# Altium schematic sheet SOM_Codec_WM8731.SchDoc
size A2; SheetNumber: 1; SheetTotal: 1
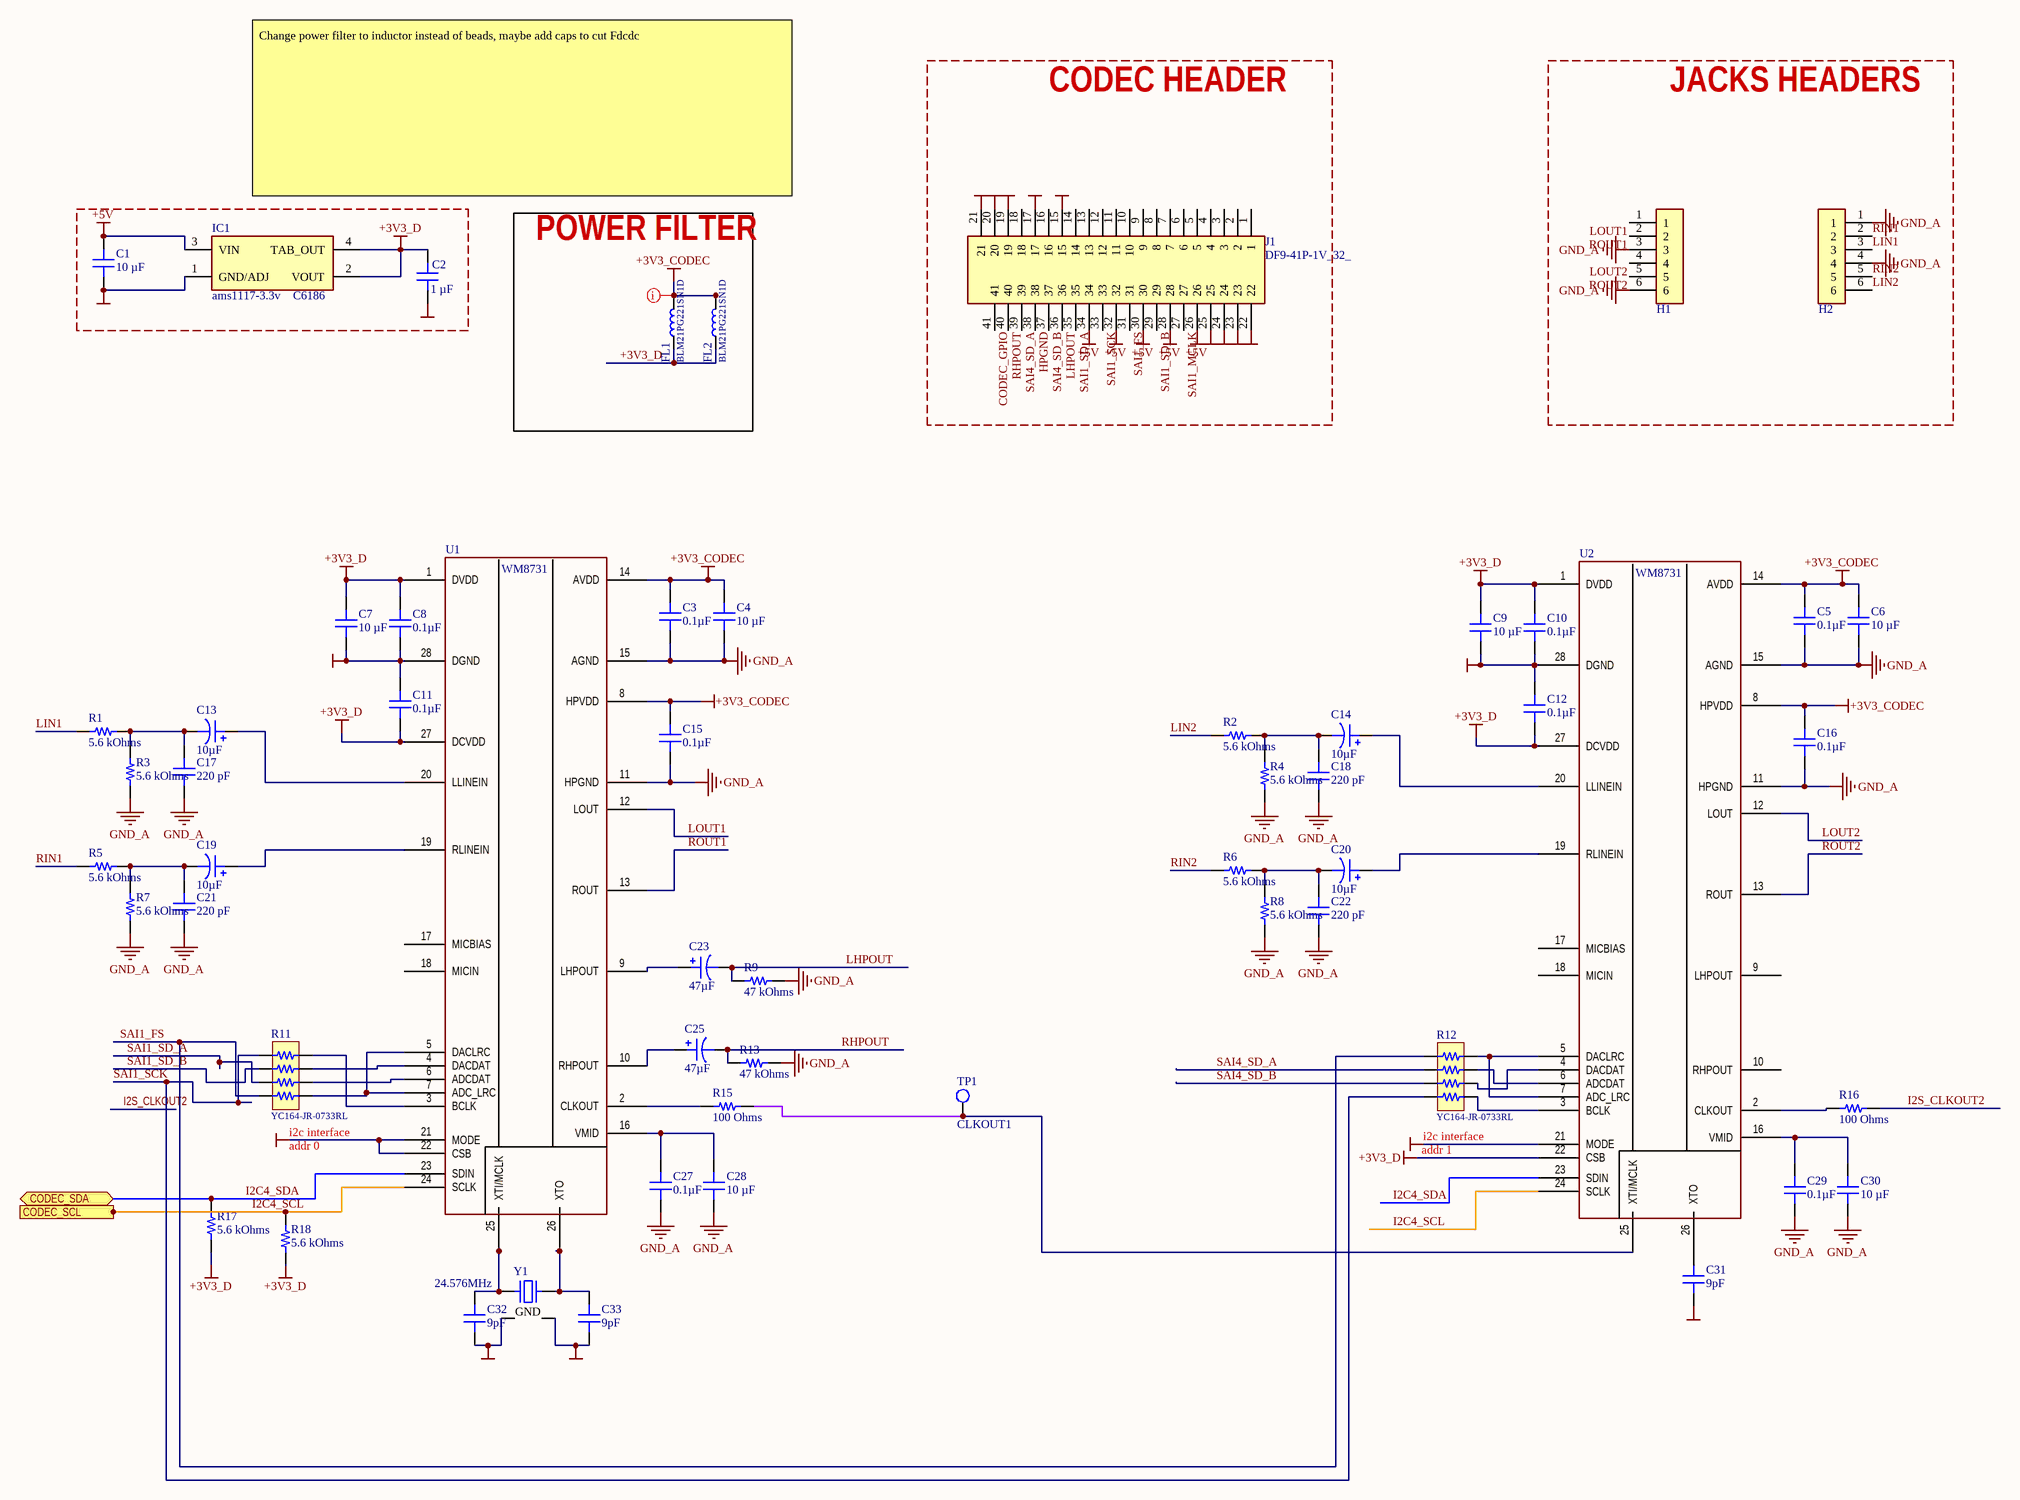
[diagram p0: SOM_Codec_WM8731.SchDoc]

## Parts
C1  10 µF  [CAP 0805_2012]
C2  1 µF  [CAP 0805_2012]
C3  0.1µF  [CAP 0402_1005]
C4  10 µF  [CAP 0805_2012]
C5  0.1µF  [CAP 0402_1005]
C6  10 µF  [CAP 0805_2012]
C7  10 µF  [CAP 0805_2012]
C8  0.1µF  [CAP 0402_1005]
C9  10 µF  [CAP 0805_2012]
C10  0.1µF  [CAP 0402_1005]
C11  0.1µF  [CAP 0402_1005]
C12  0.1µF  [CAP 0402_1005]
C13  10µF  [CAP POL 1206_3216]
C14  10µF  [CAP POL 1206_3216]
C15  0.1µF  [CAP 0402_1005]
C16  0.1µF  [CAP 0402_1005]
C17  220 pF  [CAP 0603_1608]
C18  220 pF  [CAP 0603_1608]
C19  10µF  [CAP POL 1206_3216]
C20  10µF  [CAP POL 1206_3216]
C21  220 pF  [CAP 0603_1608]
C22  220 pF  [CAP 0603_1608]
C23  47µF  [CAP POL 2917_7343]
C25  47µF  [CAP POL 2917_7343]
C27  0.1µF  [CAP 0402_1005]
C28  10 µF  [CAP 0805_2012]
C29  0.1µF  [CAP 0402_1005]
C30  10 µF  [CAP 0805_2012]
C31  9pF  [CAP 0805_2012]
C32  9pF  [CAP 0805_2012]
C33  9pF  [CAP 0805_2012]
FL1  BLM21PG221SN1D  [0805_IND]
FL2  BLM21PG221SN1D  [0805_IND]
H1  1.5-6A  [1.5-6A]  (value not drawn)
H2  1.5-6A  [1.5-6A]  (value not drawn)
IC1  ams1117-3.3v  Supplier Part Number 1: C6186  [SOT-223]
J1  DF9-41P-1V_32_  [HIROSE_DF9-41P-1V(32)]
R1  5.6 kOhms  [RES 0603_1608]
R2  5.6 kOhms  [RES 0603_1608]
R3  5.6 kOhms  [RES 0603_1608]
R4  5.6 kOhms  [RES 0603_1608]
R5  5.6 kOhms  [RES 0603_1608]
R6  5.6 kOhms  [RES 0603_1608]
R7  5.6 kOhms  [RES 0603_1608]
R8  5.6 kOhms  [RES 0603_1608]
R9  47 kOhms  [RES 0603_1608]
R11  YC164-JR-0733RL  [RESNET 1206-8 CONVEX]
R12  YC164-JR-0733RL  [RESNET 1206-8 CONVEX]
R13  47 kOhms  [RES 0603_1608]
R15  100 Ohms  [RES 0402_1005]
R16  100 Ohms  [RES 0402_1005]
R17  5.6 kOhms  [RES 0603_1608]
R18  5.6 kOhms  [RES 0603_1608]
TP1  CLKOUT1  [TESTPOINT]  (no BOM)
U1  WM8731  [TSSOP-28]
U2  WM8731  [TSSOP-28]
Y1  24.576MHz  [ABRACON ABM8G]

## Blocks framed on the sheet
CODEC HEADER: J1
JACKS HEADERS: H1 H2
POWER FILTER: FL1 FL2

## Ports
CODEC_SCL (in), CODEC_SDA (bidir)

## Nets
+3V3_CODEC: C3.2 C4.2 C5.2 C6.2 C15.2 C16.2 FL1.2 FL2.2 U1.8(HPVDD) U1.14(AVDD) U2.8(HPVDD) U2.14(AVDD)
+3V3_D: C2.2 C7.2 C8.2 C9.2 C10.2 C11.1 C12.1 FL1.1 FL2.1 IC1.2(VOUT) IC1.4(TAB_OUT) R17.1 R18.1 U1.1(DVDD) U1.27(DCVDD) U2.1(DVDD) U2.22(CSB) U2.27(DCVDD)
+5V: C1.2 IC1.3(VIN) J1.26 J1.28 J1.30 J1.32 J1.34
GND: C1.1 C2.1 C7.1 C8.1 C9.1 C10.1 C11.2 C12.2 C31.2 C32.2 C33.2 IC1.1(GND/ADJ) J1.15 J1.17 J1.19 J1.20 J1.21 J1.22 J1.23 J1.24 J1.25 U1.21(MODE) U1.22(CSB) U1.28(DGND) U2.21(MODE) U2.28(DGND) Y1.2(GND) Y1.4(GND)
GND_A: C3.1 C4.1 C5.1 C6.1 C15.1 C16.1 C17.1 C18.1 C21.1 C22.1 C27.2 C28.2 C29.2 C30.2 H1.3 H1.6 H2.1 H2.4 R3.1 R4.1 R7.1 R8.1 R9.2 R13.2 U1.11(HPGND) U1.15(AGND) U2.11(HPGND) U2.15(AGND)
CODEC_GPIO: J1.41
HPGND: J1.38
I2C4_SCL: R18.2 U1.24(SCLK) U2.24(SCLK) ; port CODEC_SCL
I2C4_SDA: R17.2 U1.23(SDIN) U2.23(SDIN) ; port CODEC_SDA
I2S_CLKOUT2: R16.2
LHPOUT: C23.2 J1.36 R9.1
LIN1: H2.3 R1.1
LIN2: H2.6 R2.1
LOUT1: H1.1 U1.12(LOUT)
LOUT2: H1.4 U2.12(LOUT)
RHPOUT: C25.2 J1.40 R13.1
RIN1: H2.2 R5.1
RIN2: H2.5 R6.1
ROUT1: H1.2 U1.13(ROUT)
ROUT2: H1.5 U2.13(ROUT)
SAI1_FS: J1.31 R11.4 R12.1
SAI1_MCLK: J1.27
SAI1_SCK: J1.33 R11.1 R12.4
SAI1_SD_A: J1.35 R11.3
SAI1_SD_B: J1.29 R11.2
SAI4_SD_A: J1.39 R12.2
SAI4_SD_B: J1.37 R12.3
NetC13_1: C13.1 U1.20(LLINEIN)
NetC13_2: C13.2 C17.2 R1.2 R3.2
NetC14_1: C14.1 U2.20(LLINEIN)
NetC14_2: C14.2 C18.2 R2.2 R4.2
NetC19_1: C19.1 U1.19(RLINEIN)
NetC19_2: C19.2 C21.2 R5.2 R7.2
NetC20_1: C20.1 U2.19(RLINEIN)
NetC20_2: C20.2 C22.2 R6.2 R8.2
NetC23_1: C23.1 U1.9(LHPOUT)
NetC25_1: C25.1 U1.10(RHPOUT)
NetC27_1: C27.1 C28.1 U1.16(VMID)
NetC29_1: C29.1 C30.1 U2.16(VMID)
NetC31_1: C31.1 U2.26(XTO)
NetC32_1: C32.1 U1.25(XTI/MCLK) Y1.1
NetC33_1: C33.1 U1.26(XTO) Y1.3
NetR11_5: R11.5 U1.5(DACLRC) U1.7(ADC_LRC)
NetR11_6: R11.6 U1.6(ADCDAT)
NetR11_7: R11.7 U1.4(DACDAT)
NetR11_8: R11.8 U1.3(BCLK)
NetR12_5: R12.5 U2.3(BCLK)
NetR12_6: R12.6 U2.4(DACDAT)
NetR12_7: R12.7 U2.6(ADCDAT)
NetR12_8: R12.8 U2.5(DACLRC) U2.7(ADC_LRC)
NetR15_1: R15.1 U1.2(CLKOUT)
NetR15_2: R15.2 TP1.1 U2.25(XTI/MCLK)
NetR16_1: R16.1 U2.2(CLKOUT)

Not connected (* = marked no-connect by the designer): J1 1 2 3 4 5 6 7 8 9 10 11 12 13 14 16 18; U1 17(MICBIAS) 18(MICIN); U2 9(LHPOUT) 10(RHPOUT) 17(MICBIAS) 18(MICIN)

## Layout directives
net class PowerNet: +3V3_CODEC

## Notes on the sheet
- Change power filter to inductor instead of beads, maybe add caps to cut Fdcdc
- (near R11) i2c interface
- (near R11) addr 0
- (near R12) addr 1
- (near R12) i2c interface

## Library data of the parts
C1 C4 C6 C7 C9 C28 C30 = C0805C106K8PAC7800: CAP CER 10UF 10V X5R 0805; manufacturer: KEMET; Tolerance: ±10%; Part Number: C0805C106K8PAC7800; Value: 10 µF; Applications: Bypass, Decoupling; Capacitance: 10 µF; componentlink1description: Datasheet; componentlink1url: https://connect.kemet.com:7667/gateway/IntelliData-ComponentDocumentation/1.0/download/datasheet/C0805C106K8PACTU; componentlink2description: DigiKey Link; componentlink2url: https://www.digikey.com/en/products/detail/kemet/C0805C106K8PAC7800/1090830; Device Package: 0805 (2012 Metric); Lifecycle Status: Active; Minimum Order: 1; Mounting Type: Surface Mount, MLCC; Operating Temperature: -55°C ~ 85°C; Package / Case: 0805 (2012 Metric); packaging: TapeAndReel; partid: 44790; Part Status: Active; series: SMD Comm X5R; Size / Dimension: 0.079" L x 0.049" W (2.00mm x 1.25mm); Supplier 1: DigiKey; Supplier Part Number 1: 399-C0805C106K8PAC7800CT-ND; Temperature Coefficient: X5R; Thickness (Max): 0.055" (1.40mm); Voltage - Rated: 10V
  C1: lastupdated: 9/14/2022 7:51:56 AM; price: 0.02
  C4 C6 C7 C9 C28 C30: lastupdated: 9/22/2023 7:11:46 PM; price: 0.01
C2 = C0805C105K4RAC7800: CAP CER 1UF 16V X7R 0805; manufacturer: KEMET; Tolerance: ±10%; Part Number: C0805C105K4RAC7800; Value: 1 µF; Applications: Bypass, Decoupling; Capacitance: 1 µF; componentlink1description: Datasheet; componentlink1url: https://api.kemet.com/component-edge/download/datasheet/C0805C105K4RACTU.pdf; componentlink2description: DigiKey Link; componentlink2url: https://www.digikey.com/en/products/detail/kemet/C0805C105K4RAC7800/416047; Device Package: 0805 (2012 Metric); lastupdated: 9/19/2022 1:03:30 PM; Lifecycle Status: Active; Minimum Order: 1; Mounting Type: Surface Mount, MLCC; Operating Temperature: -55°C ~ 125°C; Package / Case: 0805 (2012 Metric); packaging: TapeAndReel; partid: 32075; Part Status: Active; price: 0.01; series: SMD Comm X7R; Size / Dimension: 0.079" L x 0.049" W (2.00mm x 1.25mm); Supplier 1: DigiKey; Supplier Part Number 1: 399-C0805C105K4RAC7800CT-ND; Temperature Coefficient: X7R; Thickness (Max): 0.039" (1.00mm); Voltage - Rated: 16V
C3 C5 C8 C10-C12 C15 C16 C27 C29 = C0402C104K4RACAUTO: CAP CER 0.1UF 16V X7R 0402; Manufacturer: KEMET; Tolerance: ±10%; Part Number: C0402C104K4RACAUTO; Value: 0.1µF; Applications: Automotive, Bypass, Decoupling; Capacitance: 0.1µF; ComponentLink1Description: Datasheet; ComponentLink1URL: https://api.kemet.com/component-edge/download/specsheet/C0402C104K4RACAUTO.pdf; ComponentLink2Description: DigiKey Link; ComponentLink2URL: http://digikey.com/product-detail/en/kemet/C0402C104K4RACAUTO/399-6828-1-ND/3314343; Device Package: 0402 (1005 Metric); LastUpdated: 9/2/2020 1:02:21 AM; Lifecycle Status: Active; Minimum Order: 1; Mounting Type: Surface Mount, MLCC; Operating Temperature: -55°C ~ 125°C; Package / Case: 0402 (1005 Metric); Packaging: TapeAndReel; PartId: 3024; Part Status: Active; Price: 0.01; Ratings: AEC-Q200; Series: SMD Auto X7R; Size / Dimension: 0.039" L x 0.020" W (1.00mm x 0.50mm); Supplier 1: DigiKey; Supplier Part Number 1: 399-6828-1-ND; Temperature Coefficient: X7R; Thickness (Max): 0.022" (0.55mm); Voltage - Rated: 16V
C13 C14 C19 C20 = T491A106K010AT: CAP TANT 10UF 10% 10V 1206; Manufacturer: KEMET; Manufacturer Size Code: A; ESR (Equivalent Series Resistance): 3.8Ohm; Lifetime @ Temp.: 2000 Hrs @ 125°C; Type: Molded; Part Number: T491A106K010AT; Value: 10µF; Capacitance: 10µF; ComponentLink1Description: Datasheet; ComponentLink1URL: https://api.kemet.com/component-edge/download/datasheet/T491A106K010AT.pdf; ComponentLink2Description: DigiKey Link; ComponentLink2URL: http://digikey.com/product-detail/en/kemet/T491A106K010AT/399-3684-1-ND/819009; Device Package: 1206 (3216 Metric); Features: General Purpose; Height - Seated (Max): 0.071" (1.80mm); LastUpdated: 9/2/2020 1:15:58 AM; Lifecycle Status: Active; Minimum Order: 1; Mounting Type: Surface Mount; Operating Temperature: -55°C ~ 125°C; Package / Case: 1206 (3216 Metric); Packaging: TapeAndReel; PartId: 330; Part Status: Active; Price: 0.07; Series: T491; Size / Dimension: 0.126" L x 0.063" W (3.20mm x 1.60mm); Supplier 1: DigiKey; Supplier Part Number 1: 399-3684-1-ND; Tolerance: ±10%; Voltage - Rated: 10V
C17 C18 C21 C22 = C0603C221K5RAC7867: CAP CER 220PF 50V X7R 0603; manufacturer: KEMET; Tolerance: ±10%; Part Number: C0603C221K5RAC7867; Value: 220 pF; Applications: Bypass, Decoupling; Capacitance: 220 pF; componentlink1description: Datasheet; componentlink1url: https://api.kemet.com/component-edge/download/datasheet/C0603C221K5RACTU.pdf; componentlink2description: DigiKey Link; componentlink2url: https://www.digikey.com/en/products/detail/kemet/C0603C221K5RAC7867/411073; Device Package: 0603 (1608 Metric); lastupdated: 9/22/2023 7:08:22 PM; Lifecycle Status: Active; Minimum Order: 1; Mounting Type: Surface Mount, MLCC; Operating Temperature: -55°C ~ 125°C; Package / Case: 0603 (1608 Metric); packaging: TapeAndReel; partid: 35307; Part Status: Active; price: 0.01; series: SMD Comm X7R; Size / Dimension: 0.063" L x 0.031" W (1.60mm x 0.80mm); Supplier 1: DigiKey; Supplier Part Number 1: 399-C0603C221K5RAC7867CT-ND; Temperature Coefficient: X7R; Thickness (Max): 0.034" (0.87mm); Voltage - Rated: 50V
C23 C25 = 293D476X9010D2TE3: CAP TANT 47UF 10% 10V 2917; Manufacturer: Vishay Sprague; Manufacturer Size Code: D; ESR (Equivalent Series Resistance): 700mOhm; Type: Molded; Part Number: 293D476X9010D2TE3; Value: 47µF; Capacitance: 47µF; ComponentLink1Description: Datasheet; ComponentLink1URL: http://www.vishay.com/docs/40002/293d.pdf; ComponentLink2Description: DigiKey Link; ComponentLink2URL: http://digikey.com/product-detail/en/vishay-sprague/293D476X9010D2TE3/718-1088-1-ND/1559582; Device Package: 2917 (7343 Metric); Features: General Purpose; Height - Seated (Max): 0.122" (3.10mm); LastUpdated: 9/2/2020 1:16:14 AM; Lifecycle Status: Active; Minimum Order: 1; Mounting Type: Surface Mount; Operating Temperature: -55°C ~ 125°C; Package / Case: 2917 (7343 Metric); Packaging: TapeAndReel; PartId: 2778; Part Status: Active; Price: 0.22; Series: TANTAMOUNT®, 293D; Size / Dimension: 0.287" L x 0.169" W (7.30mm x 4.30mm); Supplier 1: DigiKey; Supplier Part Number 1: 718-1088-1-ND; Tolerance: ±10%; Voltage - Rated: 10V
C31-C33 = CBR08C909CAGAC: CAP CER 9PF 250V C0G/NP0 0805; Manufacturer: KEMET; Temperature Coefficient: C0G, NP0; Tolerance: ±0.25pF; Part Number: CBR08C909CAGAC; Value: 9pF; Applications: RF, Microwave, High Frequency; Capacitance: 9pF; ComponentLink1Description: Datasheet; ComponentLink1URL: https://api.kemet.com/component-edge/download/datasheet/CBR08C909CAGAC.pdf; ComponentLink2Description: DigiKey Link; ComponentLink2URL: http://digikey.com/product-detail/en/kemet/CBR08C909CAGAC/399-8711-1-ND/3480335; Device Package: 0805 (2012 Metric); Features: High Q, Low Loss, Ultra Low ESR; LastUpdated: 9/2/2020 1:04:31 AM; Lifecycle Status: Active; Minimum Order: 1; Mounting Type: Surface Mount, MLCC; Operating Temperature: -55°C ~ 125°C; Package / Case: 0805 (2012 Metric); Packaging: TapeAndReel; PartId: 8592; Part Status: Active; Price: 0.28; Series: CBR-SMD RF C0G; Size / Dimension: 0.079" L x 0.049" W (2.00mm x 1.25mm); Supplier 1: DigiKey; Supplier Part Number 1: 399-8711-1-ND; Thickness (Max): 0.035" (0.88mm); Voltage - Rated: 250V
FL1 FL2 = BLM21PG221SN1D: ACM Series 0805 360 Ohm 220mA 500 mOhm DCR 50 V SMT Common Mode Filter
H1 H2 = 1.5-6A: Pin Header p=1.5mm, 6 pins
IC1 = ams1117-3.3v: Integrated Circuit; Manufacturer_Name: Advanced Monolithic Systems; Datasheet Link: http://www.advanced-monolithic.com/pdf/ds1117.pdf; Height: 1.8mm; Manufacturer_Part_Number: ams1117-3.3v; Supplier 1: LCSC
J1 = DF9-41P-1V_32_: Connector; Manufacturer_Name: Hirose; Manufacturer_Part_Number: DF9-41P-1V(32); Datasheet Link: http://componentsearchengine.com/Datasheets/1/DF9-41P-1V(32).pdf; Mouser Part Number: 798-DF9-41P-1V32; Mouser Price/Stock: https://www.mouser.co.uk/ProductDetail/Hirose-Connector/DF9-41P-1V32?qs=zOgoZG1CgI%252BzVCgniEkwOw%3D%3D; Arrow Part Number: DF9-41P-1V(32); Arrow Price/Stock: https://www.arrow.com/en/products/df9-41p-1v-32/hirose-electric
R1-R8 R17 R18 = RT0603DRE075K6L: RES SMD 5.6K OHM 0.5% 1/10W 0603; Manufacturer: Yageo; Power (Watts): 0.1W, 1/10W; Temperature Coefficient: ±50ppm/°C; Part Number: RT0603DRE075K6L; Value: 5.6 kOhms; ComponentLink1Description: Datasheet; ComponentLink1URL: https://www.yageo.com/upload/media/product/productsearch/datasheet/rchip/PYu-RT_1-to-0.01_RoHS_L_11.pdf; ComponentLink2Description: DigiKey Link; ComponentLink2URL: http://digikey.com/product-detail/en/yageo/RT0603DRE075K6L/311-2635-1-ND/6129054; Composition: Thin Film; Device Package: 0603 (1608 Metric); Height - Seated (Max): 0.022" (0.55mm); LastUpdated: 9/2/2020 1:10:05 AM; Lifecycle Status: Active; Minimum Order: 1; Number of Terminations: 2; Operating Temperature: -55°C ~ 155°C; Package / Case: 0603 (1608 Metric); Packaging: TapeAndReel; PartId: 14197; Part Status: Active; Price: 0.01; Resistance: 5.6 kOhms; Series: RT; Size / Dimension: 0.063" L x 0.031" W (1.60mm x 0.80mm); Supplier 1: DigiKey; Supplier Part Number 1: 311-2635-1-ND; Supplier Device Package: 0603; Tolerance: ±0.5%
R9 R13 = RT0603FRE0747KL: RES SMD 47K OHM 1% 1/10W 0603; Manufacturer: Yageo; Power (Watts): 0.1W, 1/10W; Temperature Coefficient: ±50ppm/°C; Part Number: RT0603FRE0747KL; Value: 47 kOhms; ComponentLink1Description: Datasheet; ComponentLink1URL: https://www.yageo.com/upload/media/product/productsearch/datasheet/rchip/PYu-RT_1-to-0.01_RoHS_L_11.pdf; ComponentLink2Description: DigiKey Link; ComponentLink2URL: http://digikey.com/product-detail/en/yageo/RT0603FRE0747KL/YAG3355CT-ND/5418060; Composition: Thin Film; Device Package: 0603 (1608 Metric); Height - Seated (Max): 0.022" (0.55mm); LastUpdated: 9/2/2020 1:10:23 AM; Lifecycle Status: Active; Minimum Order: 1; Number of Terminations: 2; Operating Temperature: -55°C ~ 155°C; Package / Case: 0603 (1608 Metric); Packaging: TapeAndReel; PartId: 5674; Part Status: Active; Price: 0.01; Resistance: 47 kOhms; Series: RT; Size / Dimension: 0.063" L x 0.031" W (1.60mm x 0.80mm); Supplier 1: DigiKey; Supplier Part Number 1: YAG3355CT-ND; Supplier Device Package: 0603; Tolerance: ±1%
R11 R12 = YC164-JR-0733RL: RES ARRAY 4 RES 33 OHM 1206; Manufacturer: Yageo; Circuit Type: Isolated; Number of Resistors: 4; Power Per Element: 62.5mW; Resistance (Ohms): 33; Temperature Coefficient: ±200ppm/°C; Tolerance: ±5%; Part Number: YC164-JR-0733RL; Applications: DDRAM, SDRAM; ComponentLink1Description: Datasheet; ComponentLink1URL: https://www.yageo.com/upload/media/product/productsearch/datasheet/rchip/PYu-YC_TC_group_51_RoHS_L_9.pdf; ComponentLink2Description: DigiKey Link; ComponentLink2URL: http://digikey.com/product-detail/en/yageo/YC164-JR-0733RL/YC164J-33CT-ND/1005642; Height - Seated (Max): 0.028" (0.70mm); LastUpdated: 9/2/2020 1:23:24 AM; Lifecycle Status: Active; Minimum Order: 1; Mounting Type: Surface Mount; Number of Pins: 8; Operating Temperature: -55°C ~ 155°C; Package / Case: 1206 (3216 Metric), Convex, Long Side Terminals; Packaging: TapeAndReel; PartId: 145; Part Status: Active; Price: 0.01; Series: YC164; Size / Dimension: 0.126" L x 0.063" W (3.20mm x 1.60mm); Supplier 1: DigiKey; Supplier Part Number 1: YC164J-33CT-ND
R15 R16 = RT0402FRE07100RL: RES SMD 100 OHM 1% 1/16W 0402; Manufacturer: Yageo; Power (Watts): 0.063W, 1/16W; Temperature Coefficient: ±50ppm/°C; Part Number: RT0402FRE07100RL; Value: 100 Ohms; ComponentLink1Description: Datasheet; ComponentLink1URL: https://www.yageo.com/upload/media/product/productsearch/datasheet/rchip/PYu-RT_1-to-0.01_RoHS_L_11.pdf; ComponentLink2Description: DigiKey Link; ComponentLink2URL: http://digikey.com/product-detail/en/yageo/RT0402FRE07100RL/YAG3342CT-ND/5418047; Composition: Thin Film; Device Package: 0402 (1005 Metric); Height - Seated (Max): 0.014" (0.35mm); LastUpdated: 9/2/2020 1:08:09 AM; Lifecycle Status: Active; Minimum Order: 1; Number of Terminations: 2; Operating Temperature: -55°C ~ 155°C; Package / Case: 0402 (1005 Metric); Packaging: TapeAndReel; PartId: 3193; Part Status: Active; Price: 0.01; Resistance: 100 Ohms; Series: RT; Size / Dimension: 0.039" L x 0.020" W (1.00mm x 0.50mm); Supplier 1: DigiKey; Supplier Part Number 1: YAG3342CT-ND; Supplier Device Package: 0402; Tolerance: ±1%
TP1 = TestPoint
U1 U2 = WM8731: Stero in/ot audio codec
Y1 = ABM8G-24.576MHZ-B4Y-T: CRYSTAL 24.5760MHZ 10PF SMD; Manufacturer: Abracon LLC; ESR (Equivalent Series Resistance): 60 Ohms; Frequency Stability: ±30ppm; Operating Mode: Fundamental; Part Number: ABM8G-24.576MHZ-B4Y-T; ComponentLink1Description: Datasheet; ComponentLink1URL: https://abracon.com/Resonators/ABM8G.pdf; ComponentLink2Description: DigiKey Link; ComponentLink2URL: http://digikey.com/product-detail/en/abracon-llc/ABM8G-24.576MHZ-B4Y-T/535-10296-1-ND/2218109; Device Package: 4-SMD, No Lead; Frequency: 24.576MHz; Frequency Tolerance: ±30ppm; Height - Seated (Max): 0.039" (1.00mm); LastUpdated: 3/19/2020 10:36:25 PM; Lifecycle Status: Active; Load Capacitance: 10pF; Minimum Order: 1; Mounting Type: Surface Mount; Operating Temperature: -20°C ~ 70°C; Package / Case: 4-SMD, No Lead; Packaging: TapeAndReel; PartId: 297; Part Status: Active; Price: 0.50; Series: ABM8G; Size / Dimension: 0.126" L x 0.098" W (3.20mm x 2.50mm); Supplier 1: DigiKey; Supplier Part Number 1: 535-10296-1-ND; Type: MHz Crystal; Value: 24.576MHz